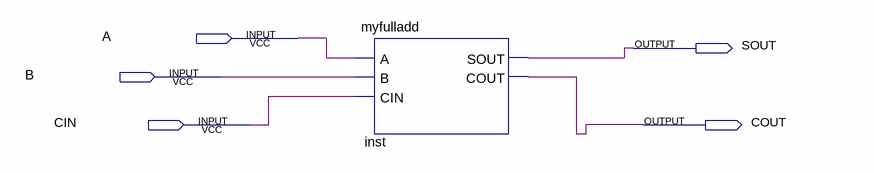
[diagram p0: schematic sheet]
// Quartus schematic Block1.bdf as structural Verilog: 1 symbols, 5 pins
module Block1 (
  input  A,
  input  B,
  input  CIN,
  output SOUT,
  output COUT
);

  myfulladd inst (.A(A), .B(B), .CIN(CIN), .SOUT(SOUT), .COUT(COUT));
endmodule
